# EasyEDA schematic SCH_三路灯带(灯带)_2021-06-06.json

## Sheets
1 原理图: TITLE: 三路灯带; REV: 1.0; Date: 2021-06-04; Sheet: 1/1; Drawn By: DF-211; Company: Your Company
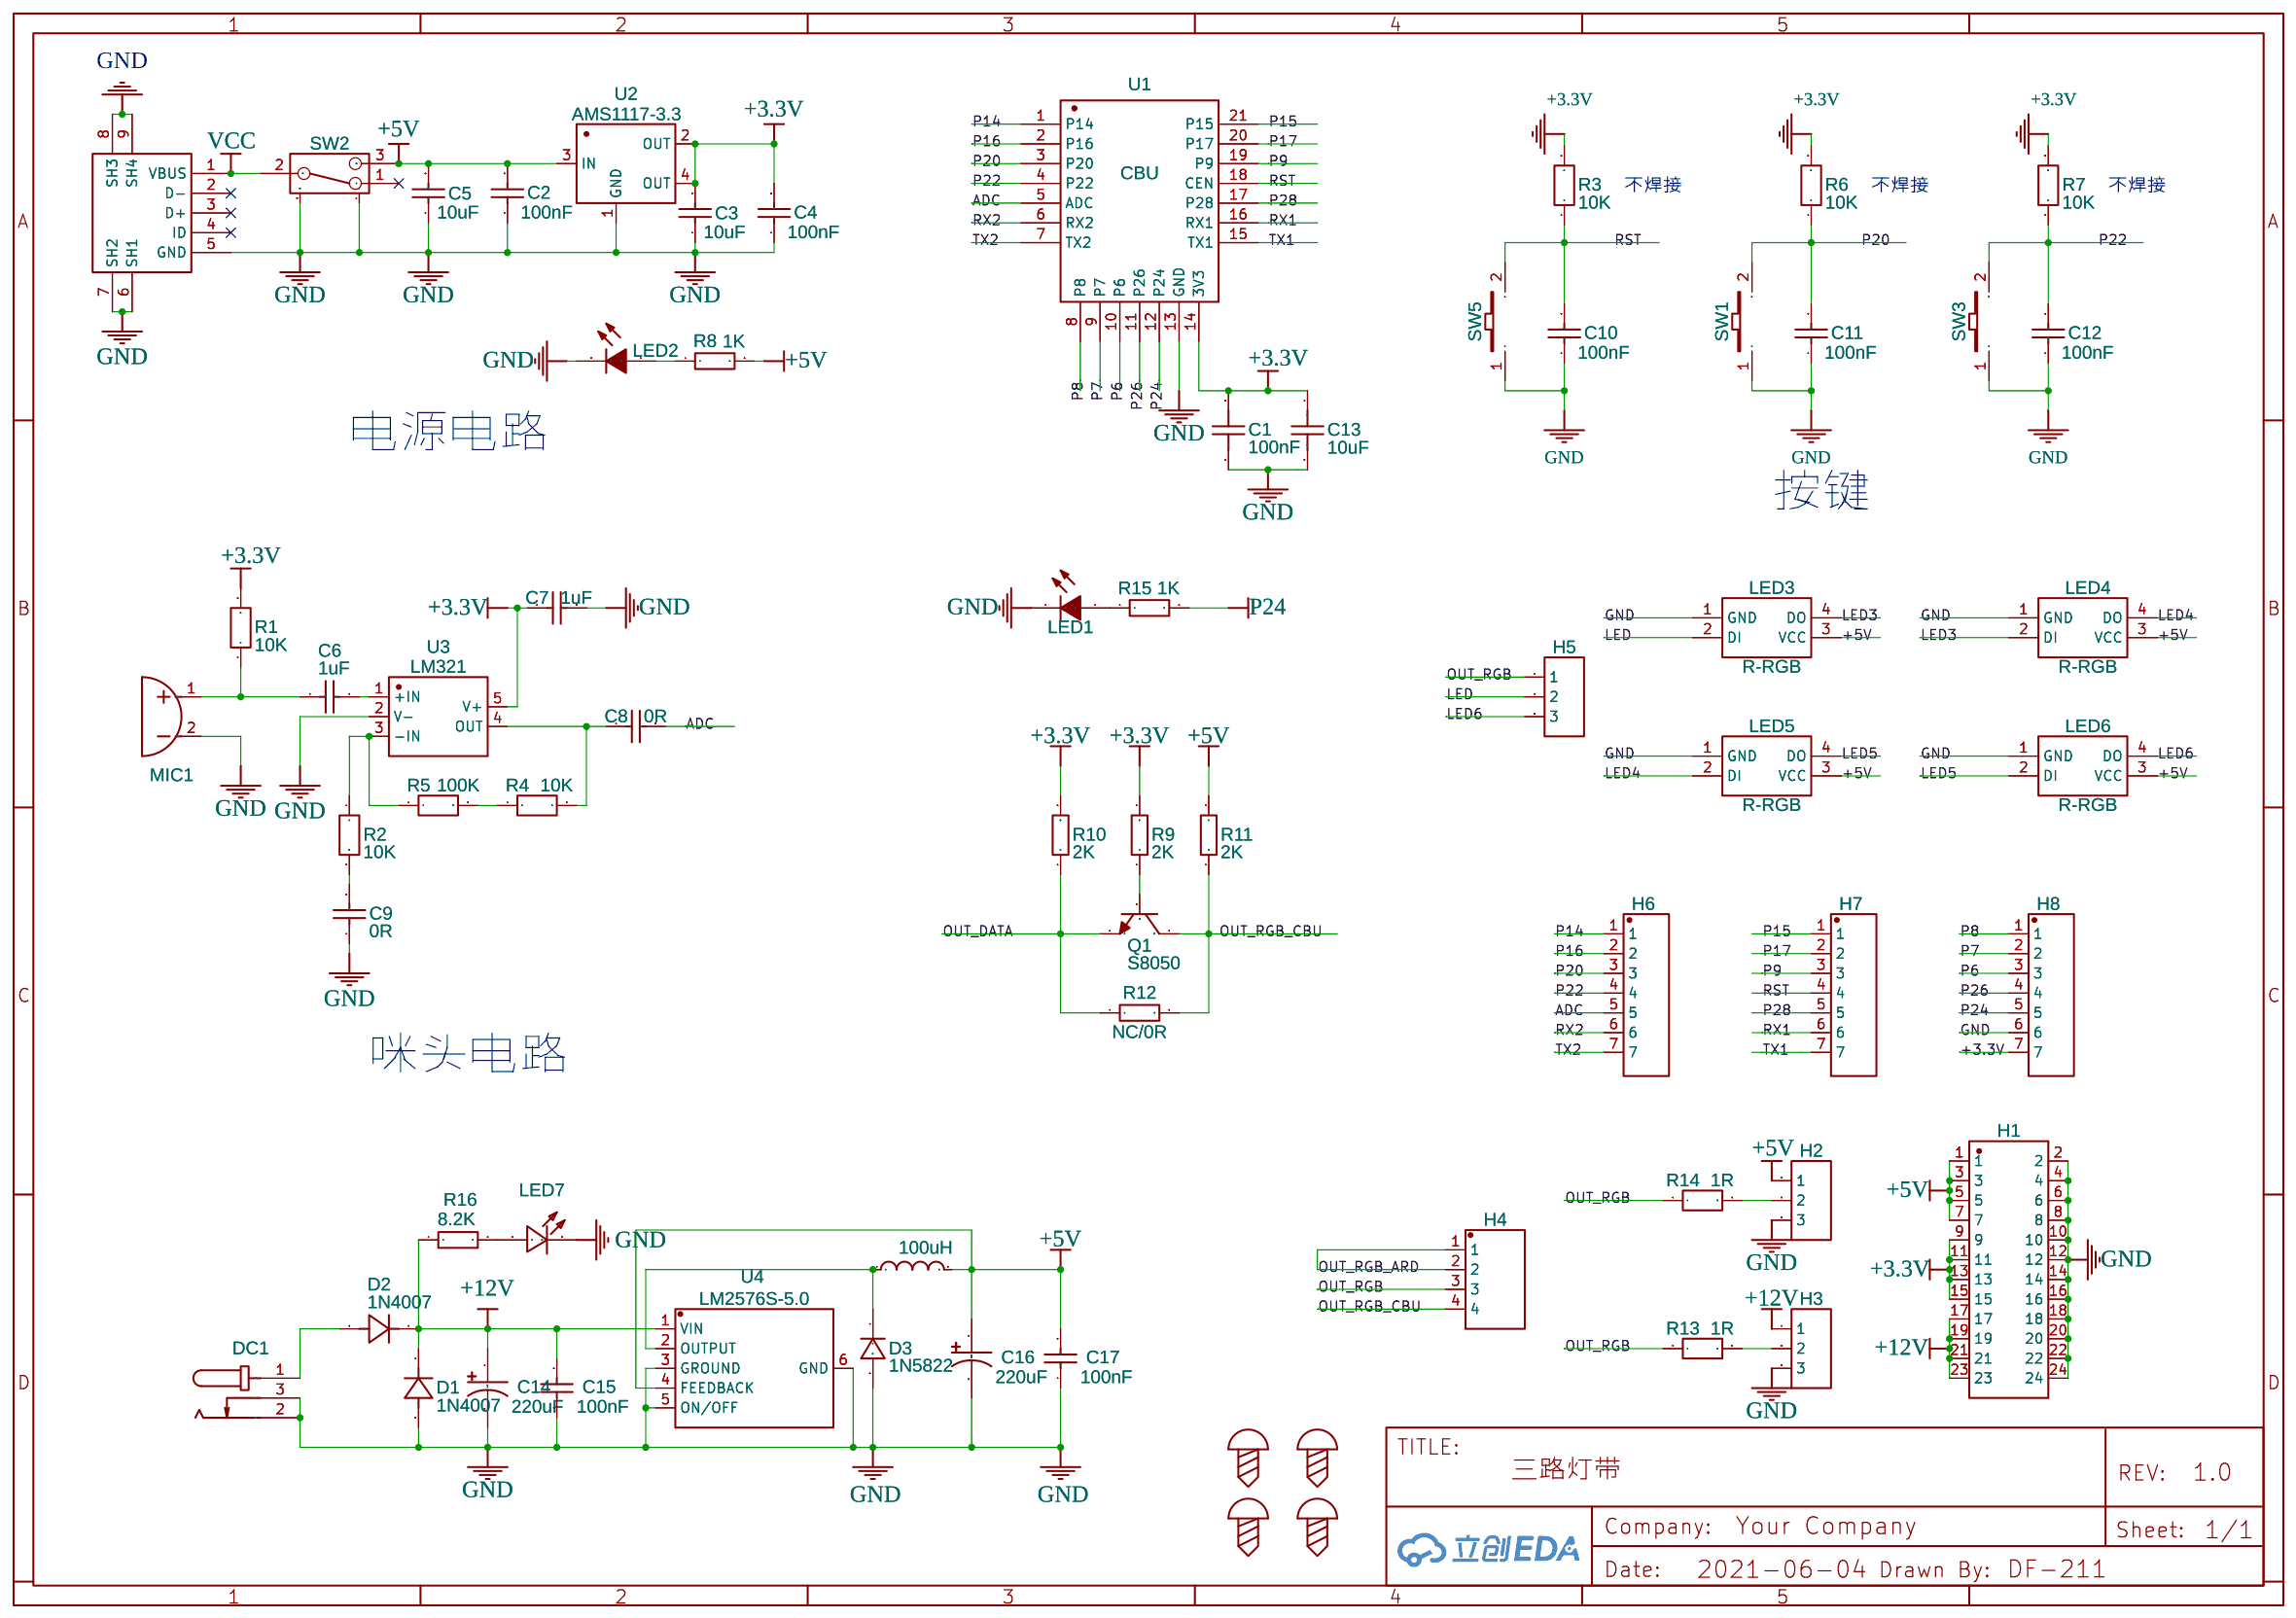
[diagram p0: 原理图]
2 WS2812灯带: TITLE: 8x16LED点阵; Date: 2020-09-08; Drawn By: Xiaole.Tao; Company: TronCool
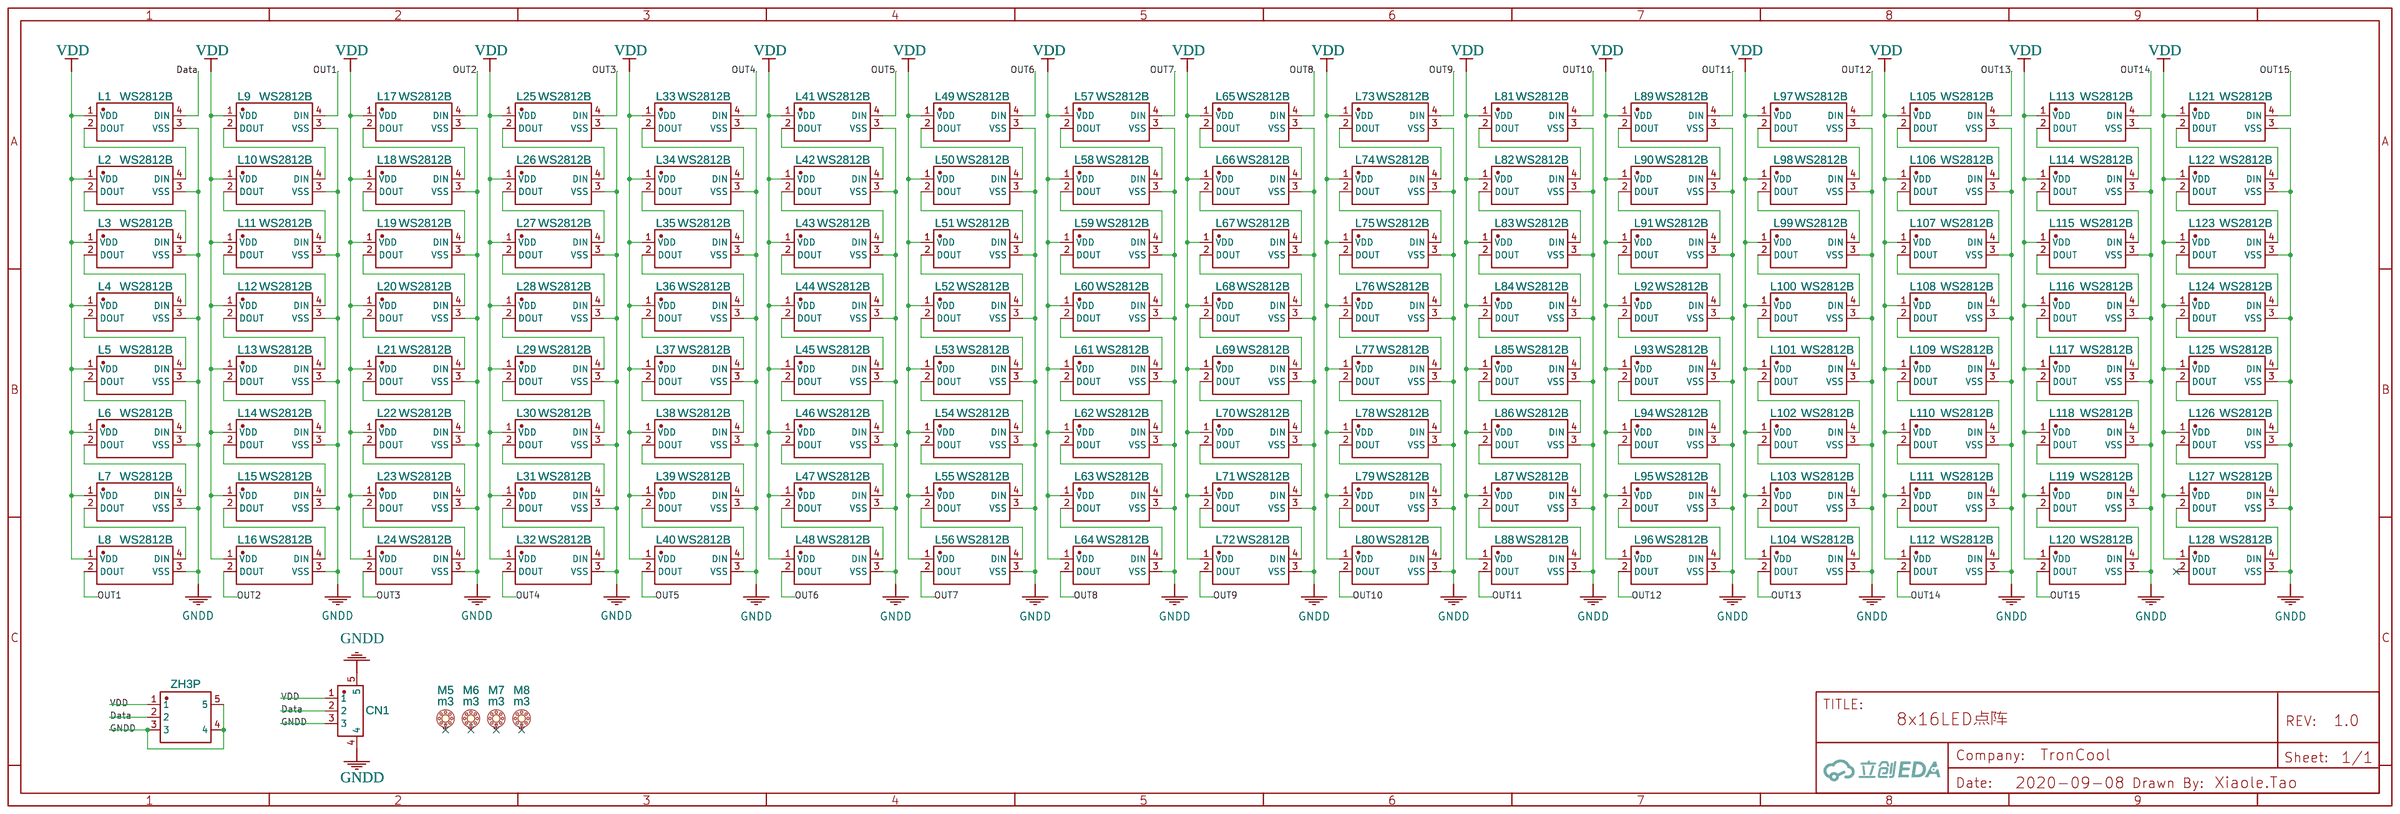
[diagram p1: WS2812灯带]

## Parts
sheet WS2812灯带
CN1  2.54-3P WT  [CONN-SMD_2.54-3P-WT]
CN6  ZH3P  [CONN-SMD_ZH1.5-3P_SMD]
L1  WS2812B  [LED-SMD_4P-L3.5-W3.5-TL_WS2812B]
L2  WS2812B  [LED-SMD_4P-L3.5-W3.5-TL_WS2812B]
L3  WS2812B  [LED-SMD_4P-L3.5-W3.5-TL_WS2812B]
L4  WS2812B  [LED-SMD_4P-L3.5-W3.5-TL_WS2812B]
L5  WS2812B  [LED-SMD_4P-L3.5-W3.5-TL_WS2812B]
L6  WS2812B  [LED-SMD_4P-L3.5-W3.5-TL_WS2812B]
L7  WS2812B  [LED-SMD_4P-L3.5-W3.5-TL_WS2812B]
L8  WS2812B  [LED-SMD_4P-L3.5-W3.5-TL_WS2812B]
L9  WS2812B  [LED-SMD_4P-L3.5-W3.5-TL_WS2812B]
L10  WS2812B  [LED-SMD_4P-L3.5-W3.5-TL_WS2812B]
L11  WS2812B  [LED-SMD_4P-L3.5-W3.5-TL_WS2812B]
L12  WS2812B  [LED-SMD_4P-L3.5-W3.5-TL_WS2812B]
L13  WS2812B  [LED-SMD_4P-L3.5-W3.5-TL_WS2812B]
L14  WS2812B  [LED-SMD_4P-L3.5-W3.5-TL_WS2812B]
L15  WS2812B  [LED-SMD_4P-L3.5-W3.5-TL_WS2812B]
L16  WS2812B  [LED-SMD_4P-L3.5-W3.5-TL_WS2812B]
L17  WS2812B  [LED-SMD_4P-L3.5-W3.5-TL_WS2812B]
L18  WS2812B  [LED-SMD_4P-L3.5-W3.5-TL_WS2812B]
L19  WS2812B  [LED-SMD_4P-L3.5-W3.5-TL_WS2812B]
L20  WS2812B  [LED-SMD_4P-L3.5-W3.5-TL_WS2812B]
L21  WS2812B  [LED-SMD_4P-L3.5-W3.5-TL_WS2812B]
L22  WS2812B  [LED-SMD_4P-L3.5-W3.5-TL_WS2812B]
L23  WS2812B  [LED-SMD_4P-L3.5-W3.5-TL_WS2812B]
L24  WS2812B  [LED-SMD_4P-L3.5-W3.5-TL_WS2812B]
L25  WS2812B  [LED-SMD_4P-L3.5-W3.5-TL_WS2812B]
L26  WS2812B  [LED-SMD_4P-L3.5-W3.5-TL_WS2812B]
L27  WS2812B  [LED-SMD_4P-L3.5-W3.5-TL_WS2812B]
L28  WS2812B  [LED-SMD_4P-L3.5-W3.5-TL_WS2812B]
L29  WS2812B  [LED-SMD_4P-L3.5-W3.5-TL_WS2812B]
L30  WS2812B  [LED-SMD_4P-L3.5-W3.5-TL_WS2812B]
L31  WS2812B  [LED-SMD_4P-L3.5-W3.5-TL_WS2812B]
L32  WS2812B  [LED-SMD_4P-L3.5-W3.5-TL_WS2812B]
L33  WS2812B  [LED-SMD_4P-L3.5-W3.5-TL_WS2812B]
L34  WS2812B  [LED-SMD_4P-L3.5-W3.5-TL_WS2812B]
L35  WS2812B  [LED-SMD_4P-L3.5-W3.5-TL_WS2812B]
L36  WS2812B  [LED-SMD_4P-L3.5-W3.5-TL_WS2812B]
L37  WS2812B  [LED-SMD_4P-L3.5-W3.5-TL_WS2812B]
L38  WS2812B  [LED-SMD_4P-L3.5-W3.5-TL_WS2812B]
L39  WS2812B  [LED-SMD_4P-L3.5-W3.5-TL_WS2812B]
L40  WS2812B  [LED-SMD_4P-L3.5-W3.5-TL_WS2812B]
L41  WS2812B  [LED-SMD_4P-L3.5-W3.5-TL_WS2812B]
L42  WS2812B  [LED-SMD_4P-L3.5-W3.5-TL_WS2812B]
L43  WS2812B  [LED-SMD_4P-L3.5-W3.5-TL_WS2812B]
L44  WS2812B  [LED-SMD_4P-L3.5-W3.5-TL_WS2812B]
L45  WS2812B  [LED-SMD_4P-L3.5-W3.5-TL_WS2812B]
L46  WS2812B  [LED-SMD_4P-L3.5-W3.5-TL_WS2812B]
L47  WS2812B  [LED-SMD_4P-L3.5-W3.5-TL_WS2812B]
L48  WS2812B  [LED-SMD_4P-L3.5-W3.5-TL_WS2812B]
L49  WS2812B  [LED-SMD_4P-L3.5-W3.5-TL_WS2812B]
L50  WS2812B  [LED-SMD_4P-L3.5-W3.5-TL_WS2812B]
L51  WS2812B  [LED-SMD_4P-L3.5-W3.5-TL_WS2812B]
L52  WS2812B  [LED-SMD_4P-L3.5-W3.5-TL_WS2812B]
L53  WS2812B  [LED-SMD_4P-L3.5-W3.5-TL_WS2812B]
L54  WS2812B  [LED-SMD_4P-L3.5-W3.5-TL_WS2812B]
L55  WS2812B  [LED-SMD_4P-L3.5-W3.5-TL_WS2812B]
L56  WS2812B  [LED-SMD_4P-L3.5-W3.5-TL_WS2812B]
L57  WS2812B  [LED-SMD_4P-L3.5-W3.5-TL_WS2812B]
L58  WS2812B  [LED-SMD_4P-L3.5-W3.5-TL_WS2812B]
L59  WS2812B  [LED-SMD_4P-L3.5-W3.5-TL_WS2812B]
L60  WS2812B  [LED-SMD_4P-L3.5-W3.5-TL_WS2812B]
L61  WS2812B  [LED-SMD_4P-L3.5-W3.5-TL_WS2812B]
L62  WS2812B  [LED-SMD_4P-L3.5-W3.5-TL_WS2812B]
L63  WS2812B  [LED-SMD_4P-L3.5-W3.5-TL_WS2812B]
L64  WS2812B  [LED-SMD_4P-L3.5-W3.5-TL_WS2812B]
L65  WS2812B  [LED-SMD_4P-L3.5-W3.5-TL_WS2812B]
L66  WS2812B  [LED-SMD_4P-L3.5-W3.5-TL_WS2812B]
L67  WS2812B  [LED-SMD_4P-L3.5-W3.5-TL_WS2812B]
L68  WS2812B  [LED-SMD_4P-L3.5-W3.5-TL_WS2812B]
L69  WS2812B  [LED-SMD_4P-L3.5-W3.5-TL_WS2812B]
L70  WS2812B  [LED-SMD_4P-L3.5-W3.5-TL_WS2812B]
L71  WS2812B  [LED-SMD_4P-L3.5-W3.5-TL_WS2812B]
L72  WS2812B  [LED-SMD_4P-L3.5-W3.5-TL_WS2812B]
L73  WS2812B  [LED-SMD_4P-L3.5-W3.5-TL_WS2812B]
L74  WS2812B  [LED-SMD_4P-L3.5-W3.5-TL_WS2812B]
L75  WS2812B  [LED-SMD_4P-L3.5-W3.5-TL_WS2812B]
L76  WS2812B  [LED-SMD_4P-L3.5-W3.5-TL_WS2812B]
L77  WS2812B  [LED-SMD_4P-L3.5-W3.5-TL_WS2812B]
L78  WS2812B  [LED-SMD_4P-L3.5-W3.5-TL_WS2812B]
L79  WS2812B  [LED-SMD_4P-L3.5-W3.5-TL_WS2812B]
L80  WS2812B  [LED-SMD_4P-L3.5-W3.5-TL_WS2812B]
L81  WS2812B  [LED-SMD_4P-L3.5-W3.5-TL_WS2812B]
L82  WS2812B  [LED-SMD_4P-L3.5-W3.5-TL_WS2812B]
L83  WS2812B  [LED-SMD_4P-L3.5-W3.5-TL_WS2812B]
L84  WS2812B  [LED-SMD_4P-L3.5-W3.5-TL_WS2812B]
L85  WS2812B  [LED-SMD_4P-L3.5-W3.5-TL_WS2812B]
L86  WS2812B  [LED-SMD_4P-L3.5-W3.5-TL_WS2812B]
L87  WS2812B  [LED-SMD_4P-L3.5-W3.5-TL_WS2812B]
L88  WS2812B  [LED-SMD_4P-L3.5-W3.5-TL_WS2812B]
L89  WS2812B  [LED-SMD_4P-L3.5-W3.5-TL_WS2812B]
L90  WS2812B  [LED-SMD_4P-L3.5-W3.5-TL_WS2812B]
L91  WS2812B  [LED-SMD_4P-L3.5-W3.5-TL_WS2812B]
L92  WS2812B  [LED-SMD_4P-L3.5-W3.5-TL_WS2812B]
L93  WS2812B  [LED-SMD_4P-L3.5-W3.5-TL_WS2812B]
L94  WS2812B  [LED-SMD_4P-L3.5-W3.5-TL_WS2812B]
L95  WS2812B  [LED-SMD_4P-L3.5-W3.5-TL_WS2812B]
L96  WS2812B  [LED-SMD_4P-L3.5-W3.5-TL_WS2812B]
L97  WS2812B  [LED-SMD_4P-L3.5-W3.5-TL_WS2812B]
L98  WS2812B  [LED-SMD_4P-L3.5-W3.5-TL_WS2812B]
L99  WS2812B  [LED-SMD_4P-L3.5-W3.5-TL_WS2812B]
L100  WS2812B  [LED-SMD_4P-L3.5-W3.5-TL_WS2812B]
L101  WS2812B  [LED-SMD_4P-L3.5-W3.5-TL_WS2812B]
L102  WS2812B  [LED-SMD_4P-L3.5-W3.5-TL_WS2812B]
L103  WS2812B  [LED-SMD_4P-L3.5-W3.5-TL_WS2812B]
L104  WS2812B  [LED-SMD_4P-L3.5-W3.5-TL_WS2812B]
L105  WS2812B  [LED-SMD_4P-L3.5-W3.5-TL_WS2812B]
L106  WS2812B  [LED-SMD_4P-L3.5-W3.5-TL_WS2812B]
L107  WS2812B  [LED-SMD_4P-L3.5-W3.5-TL_WS2812B]
L108  WS2812B  [LED-SMD_4P-L3.5-W3.5-TL_WS2812B]
L109  WS2812B  [LED-SMD_4P-L3.5-W3.5-TL_WS2812B]
L110  WS2812B  [LED-SMD_4P-L3.5-W3.5-TL_WS2812B]
L111  WS2812B  [LED-SMD_4P-L3.5-W3.5-TL_WS2812B]
L112  WS2812B  [LED-SMD_4P-L3.5-W3.5-TL_WS2812B]
L113  WS2812B  [LED-SMD_4P-L3.5-W3.5-TL_WS2812B]
L114  WS2812B  [LED-SMD_4P-L3.5-W3.5-TL_WS2812B]
L115  WS2812B  [LED-SMD_4P-L3.5-W3.5-TL_WS2812B]
L116  WS2812B  [LED-SMD_4P-L3.5-W3.5-TL_WS2812B]
L117  WS2812B  [LED-SMD_4P-L3.5-W3.5-TL_WS2812B]
L118  WS2812B  [LED-SMD_4P-L3.5-W3.5-TL_WS2812B]
L119  WS2812B  [LED-SMD_4P-L3.5-W3.5-TL_WS2812B]
L120  WS2812B  [LED-SMD_4P-L3.5-W3.5-TL_WS2812B]
L121  WS2812B  [LED-SMD_4P-L3.5-W3.5-TL_WS2812B]
L122  WS2812B  [LED-SMD_4P-L3.5-W3.5-TL_WS2812B]
L123  WS2812B  [LED-SMD_4P-L3.5-W3.5-TL_WS2812B]
L124  WS2812B  [LED-SMD_4P-L3.5-W3.5-TL_WS2812B]
L125  WS2812B  [LED-SMD_4P-L3.5-W3.5-TL_WS2812B]
L126  WS2812B  [LED-SMD_4P-L3.5-W3.5-TL_WS2812B]
L127  WS2812B  [LED-SMD_4P-L3.5-W3.5-TL_WS2812B]
L128  WS2812B  [LED-SMD_4P-L3.5-W3.5-TL_WS2812B]
M5  m3  [M3N]
M6  m3  [M3N]
M7  m3  [M3N]
M8  m3  [M3N]
sheet 原理图
C1  100nF  [C0805]
C2  100nF  [C0805]
C3  10uF  [C0805]
C4  100nF  [C0805]
C5  10uF  [C0805]
C6  1uF  [C0805]
C7  1uF  [C0805]
C8  0R  [C0805]
C9  0R  [C0805]
C10  100nF  [C0805]
C11  100nF  [C0805]
C12  100nF  [C0805]
C13  10uF  [C0805]
C14  220uF  [CAP-SMD_BD10.0-L10.3-W10.3-FD]
C15  100nF  [C0805]
C16  220uF  [CAP-SMD_BD10.0-L10.3-W10.3-FD]
C17  100nF  [C0805]
D1  1N4007  [SMA_L4.4-W2.8-LS5.4-RD]
D2  1N4007  [SMA_L4.4-W2.8-LS5.4-RD]
D3  1N5822  [SMA_L4.4-W2.6-LS5.0-RD]
DC1  DC-005A-20A  [DC-IN-TH_DC-005A-20A]
H1  A2541HWV-2X12P  [HDR-TH_24P-P2.54-V-R2-C12-S2.54]
H2  Header-Male-2.54_1x3  [HDR-TH_3P-P2.54-V]
H3  Header-Male-2.54_1x3  [HDR-TH_3P-P2.54-V]
H4  MTP125-1104S1  [HDR-TH_4P-P2.54-V]
H5  Header-Male-2.54_1x3  [HDR-TH_3P-P2.54-V]
H6  220S-1*7P H=8.5MM Ytype Gold-plated  [HDR-TH_7P-P2.54-V]
H7  220S-1*7P H=8.5MM Ytype Gold-plated  [HDR-TH_7P-P2.54-V]
H8  220S-1*7P H=8.5MM Ytype Gold-plated  [HDR-TH_7P-P2.54-V]
LED1  19-217/BHC-ZL1M2RY/3T  [LED0603-R-RD]
LED2  19-217/BHC-ZL1M2RY/3T  [LED0603-R-RD]
LED3  R-RGB  [R-WS2812B]
LED4  R-RGB  [R-WS2812B]
LED5  R-RGB  [R-WS2812B]
LED6  R-RGB  [R-WS2812B]
LED7  ORH-G35A  [LED0805-R-RD]
LL1  100uH  [IND-SMD_L12.3-W12.3]
MIC1  GMI9767P-36DB  [MIC-TH_BD9.7-P2.54-D0.8-L-FD]
Q1  S8050  [SOT-23-3_L2.9-W1.3-P1.90-LS2.4-BR]
R1  10K  [R0805]
R2  10K  [R0805]
R3  10K  [R0805]
R4  10K  [R0805]
R5  100K  [R0805]
R6  10K  [R0805]
R7  10K  [R0805]
R8  1K  [R0805]
R9  2K  [R0805]
R10  2K  [R0805]
R11  2K  [R0805]
R12  NC/0R  [R0805]
R13  1R  [R0805]
R14  1R  [R0805]
R15  1K  [R0805]
R16  8.2K  [R0805]
SW1  S2  [R-轻触开关]
SW2  SS-12D02-VG4  [SW-TH_SS-12D02-VG4]
SW3  S2  [R-轻触开关]
SW5  S2  [R-轻触开关]
TP1  M3铜柱  [M3铜柱]
TP2  M3铜柱  [M3铜柱]
TP3  M3铜柱  [M3铜柱]
TP4  M3铜柱  [M3铜柱]
U1  CBU  [模块-CBU]
U2  AMS1117-3.3  [PG-SOT223-4_L6.5-W3.5-P2.30-LS7.0-BR]
U3  LM321  [SOT-23-5_L3.0-W1.7-P0.95-LS2.8-BL]
U4  LM2576S-5.0  [TO-263-5_L10.6-W9.6-P1.70-LS15.9-BR]
USB  MICROXNJ  [MICRO-USB-SMD_MICROXNJ]

## Library data of the parts
CN1 = 2.54-3P WT: Supplier: LCSC; Supplier Part: C2681546; Manufacturer: SHOU HAN(首韩); Contributor: LCSC; JLCPCB Part Class: Extended Part
CN6 = ZH1.5-3P SMD: Supplier: LCSC; Supplier Part: C145991; Manufacturer: Boom Precision Elec; Contributor: LCSC
L1-L128 = WS2812B-MINI: Supplier: LCSC; Supplier Part: C527089; Manufacturer: Worldsemi; Manufacturer Part: WS2812B-Mini; Contributor: LCSC; SMT Type: Extend; JLCPCB SMD: Yes
M5-M8 = m3: Contributor: wei5594245
C1 = CC0603KRX7R9BB104: Supplier: LCSC; Manufacturer: YAGEO; Supplier Part: C14663; JLCPCB Part Class: Basic Part
C2 C4 C10-C12 = 0805B104K500NT: Supplier: LCSC; Manufacturer: FH; Supplier Part: C38141
C3 C5 = CL21A106KOQNNNE: Supplier: LCSC; Manufacturer: SAMSUNG; Supplier Part: C1713
C6-C9 = CL21F105ZAFNNNE: Supplier: LCSC; Manufacturer: SAMSUNG; Supplier Part: C1761
C13 = JMK212AB7106KGHT: Supplier: LCSC; Supplier Part: C386019; Manufacturer: Taiyo Yuden; Contributor: LCSC; JLCPCB Part Class: Extended Part
C14 C16 = EEEFC1E221AP: Supplier: LCSC; Supplier Part: C178520; Manufacturer: PANASONIC; Contributor: LCSC
C15 = CL21F104ZBCNNNC: Supplier: LCSC; Manufacturer: SAMSUNG; Supplier Part: C1760
C17 = CL10F104ZB8NNNC: Supplier: LCSC; Manufacturer: SAMSUNG; Supplier Part: C1688
D1 D2 = 1N4007_C727081: Supplier: LCSC; Supplier Part: C727081; Manufacturer: TWGMC; Contributor: LCSC; JLCPCB Part Class: Extended Part
D3 = 1N5822-SMA: Supplier: LCSC; Supplier Part: C364271; Manufacturer: (MDD) Jiangsu Yutai Elec; Manufacturer Part: SS36F-SMAF; Contributor: LCSC
DC1 = DC-005A-20A: Supplier: LCSC; Supplier Part: C362144; Manufacturer: Rectangular Connectors - Contacts; Contributor: LCSC
H1 = A2541HWV-2X12P: Supplier: LCSC; Supplier Part: C239352; Manufacturer: Changjiang Connectors; Manufacturer Part: A2541HWV-2x12P; Contributor: LCSC; JLCPCB Part Class: Extended Part
H2 H3 H5 = Header-Male-2.54_1x3: Supplier: LCSC; Manufacturer: BOOMELE; Manufacturer Part: Header2.54mm 1*3P; Supplier Part: C49257; JLCPCB Part Class: Extended Part
H4 = MTP125-1104S1: Supplier: LCSC; Supplier Part: C358686; Manufacturer: MINTRON; Contributor: LCSC; JLCPCB Part Class: Extended Part
H6-H8 = 220S-1*7P H=8.5MM Ytype Gold-plated: Supplier: LCSC; Manufacturer: Ckmtw; Contributor: LCSC; Supplier Part: C124418; JLCPCB Part Class: Extended Part
LED1 LED2 = 19-217/BHC-ZL1M2RY/3T: Supplier: LCSC; Manufacturer: EVERLIGHT; LCSC Assembly: Yes; image: //image.lceda.cn/szlcsc/C72041.jpg; Supplier Part: C72041; SMT Type: Basic
LED3-LED6 = R-RGB: Contributor: PQG2030PQG; Manufacturer Part: WS2812B-B; Supplier: LCSC; Manufacturer: Worldsemi; Supplier Part: C114586
LED7 = ORH-G35A: Supplier: LCSC; Supplier Part: C205442; Manufacturer: Orient; Contributor: LCSC; SMT Type: Extend; JLCPCB SMD: Yes
LL1 = GCRH125-101MC: Supplier: LCSC; Supplier Part: C439399; Manufacturer: GLE; Contributor: LCSC
MIC1 = GMI9767P-36DB: Supplier: LCSC; Supplier Part: C234015; Manufacturer: INGHAi; Contributor: LCSC; JLCPCB Part Class: Extended Part
Q1 = S8050_C908252: Supplier: LCSC; Supplier Part: C908252; Manufacturer: FUXINSEMI; Contributor: LCSC; JLCPCB Part Class: Extended Part
R1-R4 R6 R7 = RT0805WRD0710KL: Supplier: LCSC; Supplier Part: C706400; Manufacturer: YAGEO; Contributor: LCSC; JLCPCB Part Class: Extended Part
R5 = CRCW0805100KFKEA: Supplier: LCSC; Supplier Part: C844935; Manufacturer: Vishay Intertech; Contributor: LCSC
R8 R15 = 0805W8F1001T5E: Supplier: LCSC; Manufacturer: UniOhm; LCSC Assembly: Yes; Supplier Part: C17513; SMT Type: Basic
R9-R11 = RMC08052K5%N: Supplier: LCSC; Supplier Part: C269731; Manufacturer: Tyohm; Contributor: LCSC; JLCPCB Part Class: Extended Part; Paste Type: Extended Part
R12 = 0805W8J0000T5E: Supplier: LCSC; Manufacturer: UniOhm; Supplier Part: C25275; JLCPCB Part Class: Extended Part
R13 R14 = AC0805DR-071RL: Supplier: LCSC; Supplier Part: C727972; Manufacturer: YAGEO; Contributor: LCSC
R16 = 0805W8J0822T5E: Supplier: LCSC; Manufacturer: UniOhm; Supplier Part: C26028
SW1 SW3 SW5 = -: Supplier Part: C118141; Supplier: LCSC; Manufacturer: Rectangular Connectors - Contacts; Manufacturer Part: K2-1107ST-A4SW-06; Contributor: PQG2030PQG
SW2 = SS-12D02-VG4: Supplier: LCSC; Supplier Part: C136719; Manufacturer: Rectangular Connectors - Contacts; Contributor: LCSC
TP1-TP4 = M3铜柱: Contributor: 立创EDA电子小制作
U1 = 模块-CBU: Supplier: LCSC; Contributor: LXBLY
U2 = AMS1117-3.3: Supplier: LCSC; Supplier Part: C498117; Manufacturer: HGC(Huaguan Semicon); Contributor: DF-211
U3 = LM321: Supplier: LCSC; Supplier Part: C686636; Manufacturer: PJ(Pingjingsemi); Contributor: LCSC; Paste Type: Extended Part; JLCPCB Part Class: Extended Part
U4 = LM2576S-5.0/TR_C340927: Supplier: LCSC; Supplier Part: C340927; Manufacturer: Huaguan Semicon; Manufacturer Part: LM2576S-5.0/TR; Contributor: LCSC
USB = MICROXNJ: Supplier: LCSC; Supplier Part: C404969; Manufacturer: SHOU HAN; Manufacturer Part: MicroXNJ; Contributor: LCSC; JLCPCB Part Class: Extended Part

## Nets
+3.3V: C1.2 C3.2 C4.2 C7.1 C13.1 H1.9 H1.11 H1.13 H1.15 H8.7 R1.2 R3.2 R6.2 R7.2 R9.2 R10.2 U1.14(3V3) U2.2(OUT) U2.4(OUT) U3.5(V+)
+5V: C2.2 C5.2 C16.1 C17.2 H1.1 H1.3 H1.5 H1.7 H2.1 LED3.3(VCC) LED4.3(VCC) LED5.3(VCC) LED6.3(VCC) LL1.2 R8.2 R11.2 SW2.3 U2.3(IN) U4.4(FEEDBACK)
+12V: C14.1 C15.2 D1.1(K) D2.1(K) H1.17 H1.19 H1.21 H1.23 H3.1 R16.1 U4.1(VIN)
GND: C1.1 C2.1 C3.1 C4.1 C5.1 C7.2 C9.1 C10.1 C11.1 C12.1 C13.2 C14.2 C15.1 C16.2 C17.1 D1.2(A) D3.2 DC1.2 DC1.3 H1.2 H1.4 H1.6 H1.8 H1.10 H1.12 H1.14 H1.16 H1.18 H1.20 H1.22 H1.24 H2.3 H3.3 H8.6 LED1.2(C) LED2.2(C) LED3.1(GND) LED4.1(GND) LED5.1(GND) LED6.1(GND) LED7.2(C) MIC1.2 SW1.1 SW2.4 SW2.5 SW3.1 SW5.1 U1.13(GND) U2.1(GND) U3.2(V-) U4.3(GROUND) U4.5(ON/OFF) U4.6(GND) USB.5(GND) USB.6(SH1) USB.7(SH2) USB.8(SH3) USB.9(SH4)
GNDD: CN1.3 CN1.4 CN1.5 CN6.3 CN6.4 CN6.5 L1.3(VSS) L2.3(VSS) L3.3(VSS) L4.3(VSS) L5.3(VSS) L6.3(VSS) L7.3(VSS) L8.3(VSS) L9.3(VSS) L10.3(VSS) L11.3(VSS) L12.3(VSS) L13.3(VSS) L14.3(VSS) L15.3(VSS) L16.3(VSS) L17.3(VSS) L18.3(VSS) L19.3(VSS) L20.3(VSS) L21.3(VSS) L22.3(VSS) L23.3(VSS) L24.3(VSS) L25.3(VSS) L26.3(VSS) L27.3(VSS) L28.3(VSS) L29.3(VSS) L30.3(VSS) L31.3(VSS) L32.3(VSS) L33.3(VSS) L34.3(VSS) L35.3(VSS) L36.3(VSS) L37.3(VSS) L38.3(VSS) L39.3(VSS) L40.3(VSS) L41.3(VSS) L42.3(VSS) L43.3(VSS) L44.3(VSS) L45.3(VSS) L46.3(VSS) L47.3(VSS) L48.3(VSS) L49.3(VSS) L50.3(VSS) L51.3(VSS) L52.3(VSS) L53.3(VSS) L54.3(VSS) L55.3(VSS) L56.3(VSS) L57.3(VSS) L58.3(VSS) L59.3(VSS) L60.3(VSS) L61.3(VSS) L62.3(VSS) L63.3(VSS) L64.3(VSS) L65.3(VSS) L66.3(VSS) L67.3(VSS) L68.3(VSS) L69.3(VSS) L70.3(VSS) L71.3(VSS) L72.3(VSS) L73.3(VSS) L74.3(VSS) L75.3(VSS) L76.3(VSS) L77.3(VSS) L78.3(VSS) L79.3(VSS) L80.3(VSS) L81.3(VSS) L82.3(VSS) L83.3(VSS) L84.3(VSS) L85.3(VSS) L86.3(VSS) L87.3(VSS) L88.3(VSS) L89.3(VSS) L90.3(VSS) L91.3(VSS) L92.3(VSS) L93.3(VSS) L94.3(VSS) L95.3(VSS) L96.3(VSS) L97.3(VSS) L98.3(VSS) L99.3(VSS) L100.3(VSS) L101.3(VSS) L102.3(VSS) L103.3(VSS) L104.3(VSS) L105.3(VSS) L106.3(VSS) L107.3(VSS) L108.3(VSS) L109.3(VSS) L110.3(VSS) L111.3(VSS) L112.3(VSS) L113.3(VSS) L114.3(VSS) L115.3(VSS) L116.3(VSS) L117.3(VSS) L118.3(VSS) L119.3(VSS) L120.3(VSS) L121.3(VSS) L122.3(VSS) L123.3(VSS) L124.3(VSS) L125.3(VSS) L126.3(VSS) L127.3(VSS) L128.3(VSS)
VCC: SW2.2 USB.1(VBUS)
VDD: CN1.1 CN6.1 L1.1(VDD) L2.1(VDD) L3.1(VDD) L4.1(VDD) L5.1(VDD) L6.1(VDD) L7.1(VDD) L8.1(VDD) L9.1(VDD) L10.1(VDD) L11.1(VDD) L12.1(VDD) L13.1(VDD) L14.1(VDD) L15.1(VDD) L16.1(VDD) L17.1(VDD) L18.1(VDD) L19.1(VDD) L20.1(VDD) L21.1(VDD) L22.1(VDD) L23.1(VDD) L24.1(VDD) L25.1(VDD) L26.1(VDD) L27.1(VDD) L28.1(VDD) L29.1(VDD) L30.1(VDD) L31.1(VDD) L32.1(VDD) L33.1(VDD) L34.1(VDD) L35.1(VDD) L36.1(VDD) L37.1(VDD) L38.1(VDD) L39.1(VDD) L40.1(VDD) L41.1(VDD) L42.1(VDD) L43.1(VDD) L44.1(VDD) L45.1(VDD) L46.1(VDD) L47.1(VDD) L48.1(VDD) L49.1(VDD) L50.1(VDD) L51.1(VDD) L52.1(VDD) L53.1(VDD) L54.1(VDD) L55.1(VDD) L56.1(VDD) L57.1(VDD) L58.1(VDD) L59.1(VDD) L60.1(VDD) L61.1(VDD) L62.1(VDD) L63.1(VDD) L64.1(VDD) L65.1(VDD) L66.1(VDD) L67.1(VDD) L68.1(VDD) L69.1(VDD) L70.1(VDD) L71.1(VDD) L72.1(VDD) L73.1(VDD) L74.1(VDD) L75.1(VDD) L76.1(VDD) L77.1(VDD) L78.1(VDD) L79.1(VDD) L80.1(VDD) L81.1(VDD) L82.1(VDD) L83.1(VDD) L84.1(VDD) L85.1(VDD) L86.1(VDD) L87.1(VDD) L88.1(VDD) L89.1(VDD) L90.1(VDD) L91.1(VDD) L92.1(VDD) L93.1(VDD) L94.1(VDD) L95.1(VDD) L96.1(VDD) L97.1(VDD) L98.1(VDD) L99.1(VDD) L100.1(VDD) L101.1(VDD) L102.1(VDD) L103.1(VDD) L104.1(VDD) L105.1(VDD) L106.1(VDD) L107.1(VDD) L108.1(VDD) L109.1(VDD) L110.1(VDD) L111.1(VDD) L112.1(VDD) L113.1(VDD) L114.1(VDD) L115.1(VDD) L116.1(VDD) L117.1(VDD) L118.1(VDD) L119.1(VDD) L120.1(VDD) L121.1(VDD) L122.1(VDD) L123.1(VDD) L124.1(VDD) L125.1(VDD) L126.1(VDD) L127.1(VDD) L128.1(VDD)
ADC: C8.2 H6.5 U1.5(ADC)
Data: CN1.2 CN6.2 L1.4(DIN)
LED: H5.2 LED3.2(DI)
LED3: LED3.4(DO) LED4.2(DI)
LED4: LED4.4(DO) LED5.2(DI)
LED5: LED5.4(DO) LED6.2(DI)
LED6: H5.3 LED6.4(DO)
OUT1: L8.2(DOUT) L9.4(DIN)
OUT2: L16.2(DOUT) L17.4(DIN)
OUT3: L24.2(DOUT) L25.4(DIN)
OUT4: L32.2(DOUT) L33.4(DIN)
OUT5: L40.2(DOUT) L41.4(DIN)
OUT6: L48.2(DOUT) L49.4(DIN)
OUT7: L56.2(DOUT) L57.4(DIN)
OUT8: L64.2(DOUT) L65.4(DIN)
OUT9: L72.2(DOUT) L73.4(DIN)
OUT10: L80.2(DOUT) L81.4(DIN)
OUT11: L88.2(DOUT) L89.4(DIN)
OUT12: L96.2(DOUT) L97.4(DIN)
OUT13: L104.2(DOUT) L105.4(DIN)
OUT14: L112.2(DOUT) L113.4(DIN)
OUT15: L120.2(DOUT) L121.4(DIN)
OUT_DATA: Q1.2(E) R10.1 R12.1
OUT_RGB: H4.3 H5.1 R13.1 R14.1
OUT_RGB_ARD: H4.1 H4.2
OUT_RGB_CBU: H4.4 Q1.3(C) R11.1 R12.2
P6: H8.3 U1.10(P6)
P7: H8.2 U1.9(P7)
P8: H8.1 U1.8(P8)
P9: H7.3 U1.19(P9)
P14: H6.1 U1.1(P14)
P15: H7.1 U1.21(P15)
P16: H6.2 U1.2(P16)
P17: H7.2 U1.20(P17)
P20: C11.2 H6.3 R6.1 SW1.2 U1.3(P20)
P22: C12.2 H6.4 R7.1 SW3.2 U1.4(P22)
P24: H8.5 R15.2 U1.12(P24)
P26: H8.4 U1.11(P26)
P28: H7.5 U1.17(P28)
RST: C10.2 H7.4 R3.1 SW5.2 U1.18(CEN)
RX1: H7.6 U1.16(RX1)
RX2: H6.6 U1.6(RX2)
TX1: H7.7 U1.15(TX1)
TX2: H6.7 U1.7(TX2)
Net-(C6-1): C6.1 MIC1.1 R1.1
Net-(C6-2): C6.2 U3.1(+IN)
Net-(C8-1): C8.1 R4.2 U3.4(OUT)
Net-(C9-2): C9.2 R2.2
Net-(D2-2): D2.2(A) DC1.1
Net-(D3-1): D3.1 LL1.1 U4.2(OUTPUT)
Net-(H2-2): H2.2 R14.2
Net-(H3-2): H3.2 R13.2
Net-(L1-2): L1.2(DOUT) L2.4(DIN)
Net-(L2-2): L2.2(DOUT) L3.4(DIN)
Net-(L3-2): L3.2(DOUT) L4.4(DIN)
Net-(L4-2): L4.2(DOUT) L5.4(DIN)
Net-(L5-2): L5.2(DOUT) L6.4(DIN)
Net-(L6-2): L6.2(DOUT) L7.4(DIN)
Net-(L7-2): L7.2(DOUT) L8.4(DIN)
Net-(L9-2): L9.2(DOUT) L10.4(DIN)
Net-(L10-2): L10.2(DOUT) L11.4(DIN)
Net-(L11-2): L11.2(DOUT) L12.4(DIN)
Net-(L12-2): L12.2(DOUT) L13.4(DIN)
Net-(L13-2): L13.2(DOUT) L14.4(DIN)
Net-(L14-2): L14.2(DOUT) L15.4(DIN)
Net-(L15-2): L15.2(DOUT) L16.4(DIN)
Net-(L17-2): L17.2(DOUT) L18.4(DIN)
Net-(L18-2): L18.2(DOUT) L19.4(DIN)
Net-(L19-2): L19.2(DOUT) L20.4(DIN)
Net-(L20-2): L20.2(DOUT) L21.4(DIN)
Net-(L21-2): L21.2(DOUT) L22.4(DIN)
Net-(L22-2): L22.2(DOUT) L23.4(DIN)
Net-(L23-2): L23.2(DOUT) L24.4(DIN)
Net-(L25-2): L25.2(DOUT) L26.4(DIN)
Net-(L26-2): L26.2(DOUT) L27.4(DIN)
Net-(L27-2): L27.2(DOUT) L28.4(DIN)
Net-(L28-2): L28.2(DOUT) L29.4(DIN)
Net-(L29-2): L29.2(DOUT) L30.4(DIN)
Net-(L30-2): L30.2(DOUT) L31.4(DIN)
Net-(L31-2): L31.2(DOUT) L32.4(DIN)
Net-(L33-2): L33.2(DOUT) L34.4(DIN)
Net-(L34-2): L34.2(DOUT) L35.4(DIN)
Net-(L35-2): L35.2(DOUT) L36.4(DIN)
Net-(L36-2): L36.2(DOUT) L37.4(DIN)
Net-(L37-2): L37.2(DOUT) L38.4(DIN)
Net-(L38-2): L38.2(DOUT) L39.4(DIN)
Net-(L39-2): L39.2(DOUT) L40.4(DIN)
Net-(L41-2): L41.2(DOUT) L42.4(DIN)
Net-(L42-2): L42.2(DOUT) L43.4(DIN)
Net-(L43-2): L43.2(DOUT) L44.4(DIN)
Net-(L44-2): L44.2(DOUT) L45.4(DIN)
Net-(L45-2): L45.2(DOUT) L46.4(DIN)
Net-(L46-2): L46.2(DOUT) L47.4(DIN)
Net-(L47-2): L47.2(DOUT) L48.4(DIN)
Net-(L49-2): L49.2(DOUT) L50.4(DIN)
Net-(L50-2): L50.2(DOUT) L51.4(DIN)
Net-(L51-2): L51.2(DOUT) L52.4(DIN)
Net-(L52-2): L52.2(DOUT) L53.4(DIN)
Net-(L53-2): L53.2(DOUT) L54.4(DIN)
Net-(L54-2): L54.2(DOUT) L55.4(DIN)
Net-(L55-2): L55.2(DOUT) L56.4(DIN)
Net-(L57-2): L57.2(DOUT) L58.4(DIN)
Net-(L58-2): L58.2(DOUT) L59.4(DIN)
Net-(L59-2): L59.2(DOUT) L60.4(DIN)
Net-(L60-2): L60.2(DOUT) L61.4(DIN)
Net-(L61-2): L61.2(DOUT) L62.4(DIN)
Net-(L62-2): L62.2(DOUT) L63.4(DIN)
Net-(L63-2): L63.2(DOUT) L64.4(DIN)
Net-(L65-2): L65.2(DOUT) L66.4(DIN)
Net-(L66-2): L66.2(DOUT) L67.4(DIN)
Net-(L67-2): L67.2(DOUT) L68.4(DIN)
Net-(L68-2): L68.2(DOUT) L69.4(DIN)
Net-(L69-2): L69.2(DOUT) L70.4(DIN)
Net-(L70-2): L70.2(DOUT) L71.4(DIN)
Net-(L71-2): L71.2(DOUT) L72.4(DIN)
Net-(L73-2): L73.2(DOUT) L74.4(DIN)
Net-(L74-2): L74.2(DOUT) L75.4(DIN)
Net-(L75-2): L75.2(DOUT) L76.4(DIN)
Net-(L76-2): L76.2(DOUT) L77.4(DIN)
Net-(L77-2): L77.2(DOUT) L78.4(DIN)
Net-(L78-2): L78.2(DOUT) L79.4(DIN)
Net-(L79-2): L79.2(DOUT) L80.4(DIN)
Net-(L81-2): L81.2(DOUT) L82.4(DIN)
Net-(L82-2): L82.2(DOUT) L83.4(DIN)
Net-(L83-2): L83.2(DOUT) L84.4(DIN)
Net-(L84-2): L84.2(DOUT) L85.4(DIN)
Net-(L85-2): L85.2(DOUT) L86.4(DIN)
Net-(L86-2): L86.2(DOUT) L87.4(DIN)
Net-(L87-2): L87.2(DOUT) L88.4(DIN)
Net-(L89-2): L89.2(DOUT) L90.4(DIN)
Net-(L90-2): L90.2(DOUT) L91.4(DIN)
Net-(L91-2): L91.2(DOUT) L92.4(DIN)
Net-(L92-2): L92.2(DOUT) L93.4(DIN)
Net-(L93-2): L93.2(DOUT) L94.4(DIN)
Net-(L94-2): L94.2(DOUT) L95.4(DIN)
Net-(L95-2): L95.2(DOUT) L96.4(DIN)
Net-(L97-2): L97.2(DOUT) L98.4(DIN)
Net-(L98-2): L98.2(DOUT) L99.4(DIN)
Net-(L99-2): L99.2(DOUT) L100.4(DIN)
Net-(L100-2): L100.2(DOUT) L101.4(DIN)
Net-(L101-2): L101.2(DOUT) L102.4(DIN)
Net-(L102-2): L102.2(DOUT) L103.4(DIN)
Net-(L103-2): L103.2(DOUT) L104.4(DIN)
Net-(L105-2): L105.2(DOUT) L106.4(DIN)
Net-(L106-2): L106.2(DOUT) L107.4(DIN)
Net-(L107-2): L107.2(DOUT) L108.4(DIN)
Net-(L108-2): L108.2(DOUT) L109.4(DIN)
Net-(L109-2): L109.2(DOUT) L110.4(DIN)
Net-(L110-2): L110.2(DOUT) L111.4(DIN)
Net-(L111-2): L111.2(DOUT) L112.4(DIN)
Net-(L113-2): L113.2(DOUT) L114.4(DIN)
Net-(L114-2): L114.2(DOUT) L115.4(DIN)
Net-(L115-2): L115.2(DOUT) L116.4(DIN)
Net-(L116-2): L116.2(DOUT) L117.4(DIN)
Net-(L117-2): L117.2(DOUT) L118.4(DIN)
Net-(L118-2): L118.2(DOUT) L119.4(DIN)
Net-(L119-2): L119.2(DOUT) L120.4(DIN)
Net-(L121-2): L121.2(DOUT) L122.4(DIN)
Net-(L122-2): L122.2(DOUT) L123.4(DIN)
Net-(L123-2): L123.2(DOUT) L124.4(DIN)
Net-(L124-2): L124.2(DOUT) L125.4(DIN)
Net-(L125-2): L125.2(DOUT) L126.4(DIN)
Net-(L126-2): L126.2(DOUT) L127.4(DIN)
Net-(L127-2): L127.2(DOUT) L128.4(DIN)
Net-(LED1-1): LED1.1(A) R15.1
Net-(LED2-1): LED2.1(A) R8.1
Net-(LED7-1): LED7.1(A) R16.2
Net-(Q1-1): Q1.1(B) R9.1
Net-(R2-1): R2.1 R5.1 U3.3(-IN)
Net-(R4-1): R4.1 R5.2

Not connected (* = marked no-connect by the designer): L128 2(DOUT)*; M5 1*; M6 1*; M7 1*; M8 1*; SW2 1*; USB 2(D-)* 3(D+)* 4(ID)*

## Notes on the sheets
sheet 1
- 不焊接
- 不焊接
- 不焊接
- 电源电路
- 按键
- 咪头电路
